# EAGLE design PDB2 (EAGLE 9.6.0)
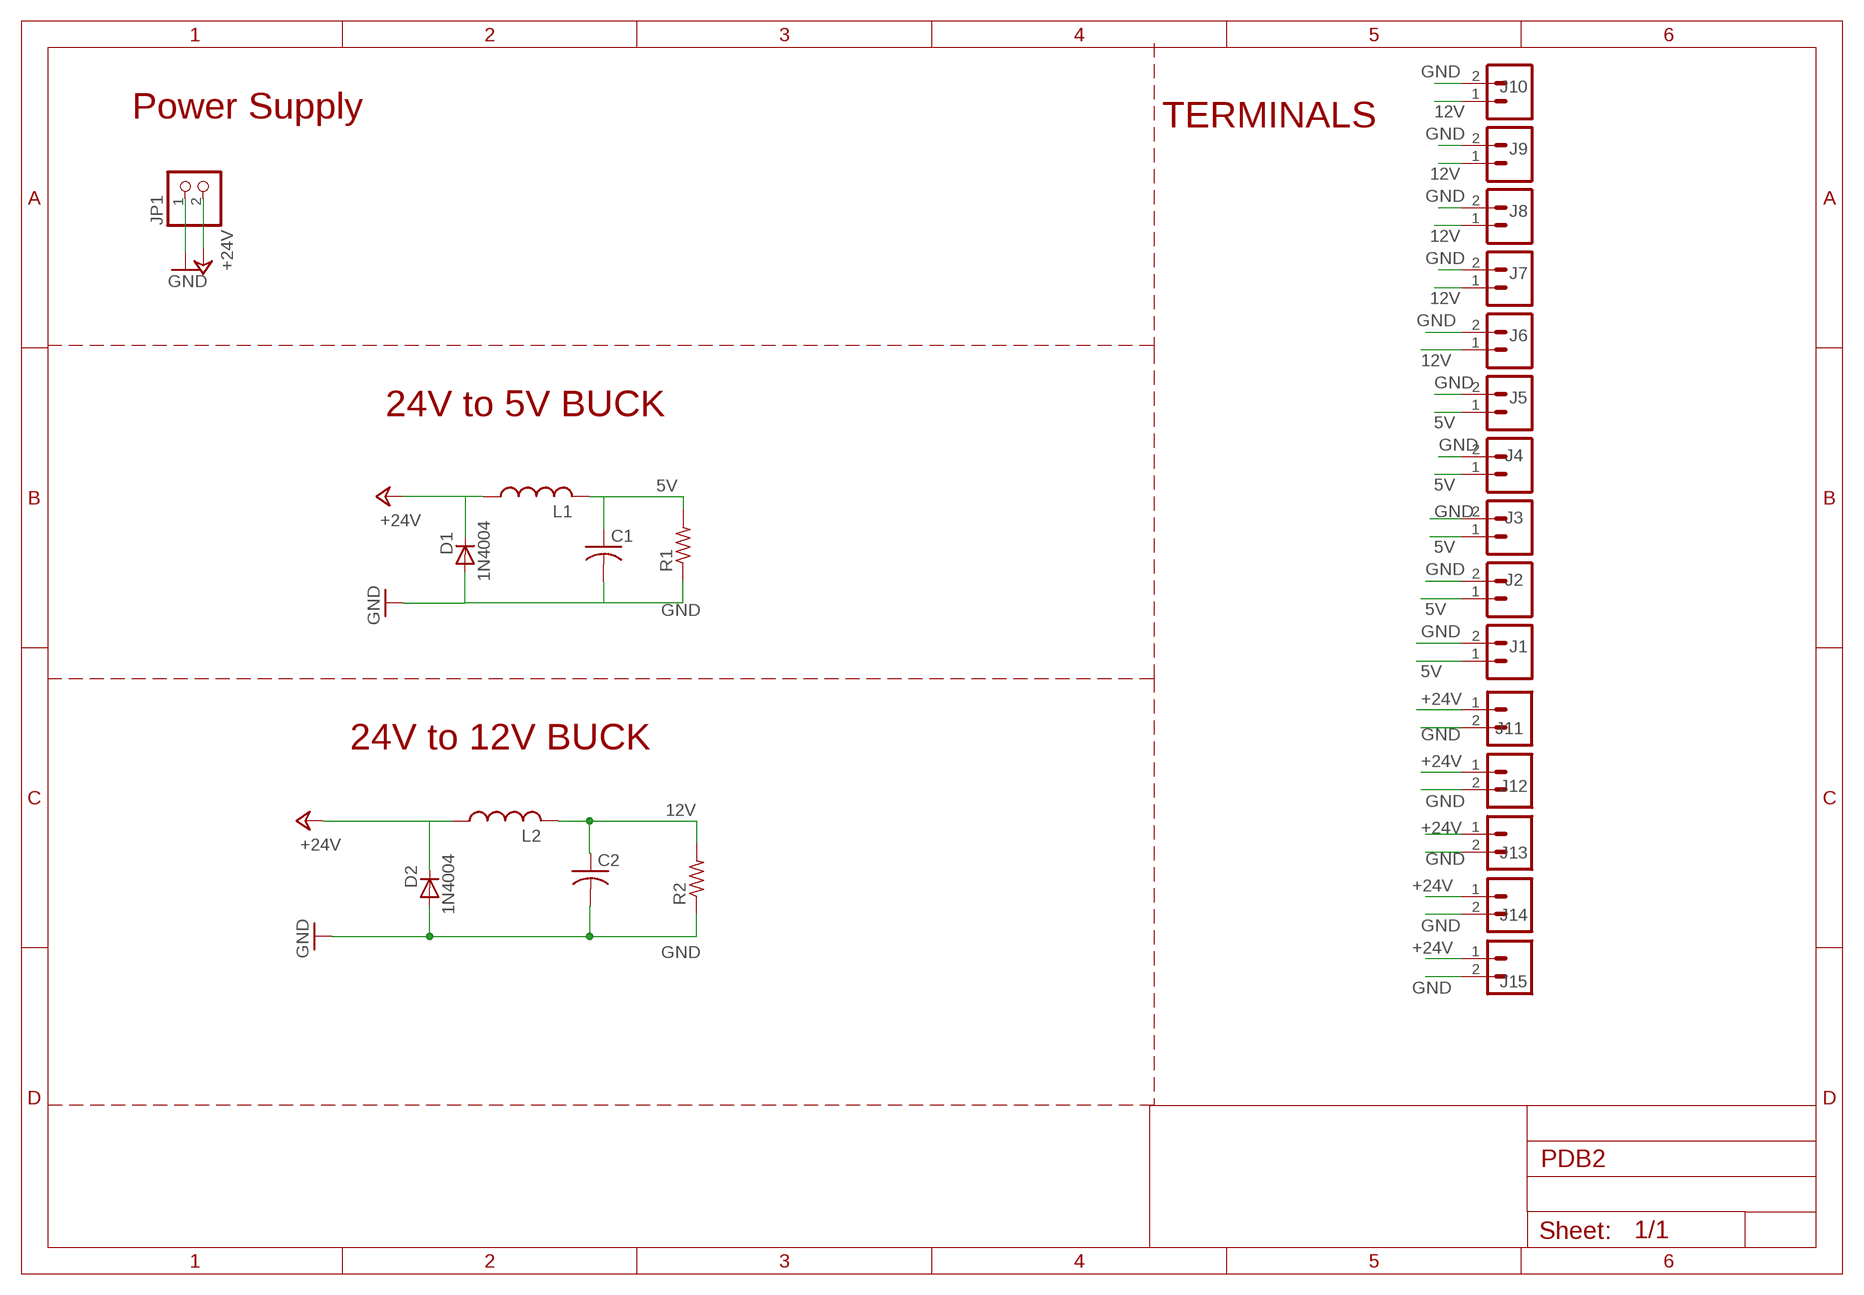
[diagram p0: schematic, sheet 1]

## Parts
C1  C-US025-050X050  [C025-050X050]
C2  C-US025-050X050  [C025-050X050]
D1  1N4004  [DO41-10]
D2  1N4004  [DO41-10]
J1  CONN_02  [1X02]
J2  CONN_02  [1X02]
J3  CONN_02  [1X02]
J4  CONN_02  [1X02]
J5  CONN_02  [1X02]
J6  CONN_02  [1X02]
J7  CONN_02  [1X02]
J8  CONN_02  [1X02]
J9  CONN_02  [1X02]
J10  CONN_02  [1X02]
J11  CONN_02  [1X02]
J12  CONN_02  [1X02]
J13  CONN_02  [1X02]
J14  CONN_02  [1X02]
J15  CONN_02  [1X02]
JP1  PINHD-1X2  [1X02]
L1  L-US0207/7  [0207/7]
L2  L-US0207/7  [0207/7]
R1  R-US_0207/10  [0207/10]
R2  R-US_0207/10  [0207/10]

## Nets
5V: C1.1 J1.1 J2.1 J3.1 J4.1 J5.1 L1.2 R1.2
12V: C2.1 J6.1 J7.1 J8.1 J9.1 J10.1 L2.2 R2.2
+24V: D1.C D2.C J11.1 J12.1 J13.1 J14.1 J15.1 JP1.2 L1.1 L2.1
GND: C1.2 C2.2 D1.A D2.A J1.2 J2.2 J3.2 J4.2 J5.2 J6.2 J7.2 J8.2 J9.2 J10.2 J11.2 J12.2 J13.2 J14.2 J15.2 JP1.1 R1.1 R2.1

## Notes on the sheet
- TERMINALS
- Power Supply
- 24V to 5V BUCK
- 24V to 12V BUCK

## Library data of the parts
C1 C2 = rcl:C-US: CAPACITOR, American symbol; SPICEPREFIX: C
D1 D2 = adafruit:1N4004: DIODE General purpose 1N400x type rectifier (With bigger pads) http://www.ladyada.net/library/pcb/eaglelibrary.html
J1-J15 = SparkFun-Connectors:CONN_02: Multi connection point. Often used as Generic Header-pin footprint for 0.1 inch spaced/style header connections On any of the 0.1 inch spaced packages, you can populate with these: Break Away Headers - Straight <https://www.sparkfun.com/products/116> (PRT-00116) Break Away Male Headers - Right Angle <https://www.sparkfun.com/products/553> (PRT-00553) Female Headers <https://www.sparkfun.com/products/115> (PRT-00115) Break Away Headers - Machine Pin <https://www.sparkfun.com/products/117> (PRT-00117) Break Away Female Headers - Swiss Machine Pin <https://www.sparkfun.com/products/743> (PRT-00743) For SCREWTERMINALS and SPRING TERMINALS visit here: Screw Terimnals on SparkFun.com <https://www.sparkfun.com/search/results?term=Screw+Terminals> (5mm/3.5mm/2.54mm spacing) This device is also useful as a general connection point to wire up your design to another part of your project. Our various solder wires solder well into these plated through hole pads. Hook-Up Wire - Assortment (Stranded, 22 AWG) <https://www.sparkfun.com/products/11375> (PRT-11375) Hook-Up Wire - Assortment (Solid Core, 22 AWG) <https://www.sparkfun.com/products/11367> (PRT-11367) View the entire wire category on our website here <https://www.sparkfun.com/categories/141> Special notes: Molex polarized connector foot print use with: PRT-08233 with associated crimp pins and housings. 2.54_SCREWTERM for use with PRT-10571. 3.5mm Screw Terminal footprints for PRT-08084 5mm Screw Terminal footprints for use with PRT-08432
JP1 = pinhead:PINHD-1X2: PIN HEADER
L1 L2 = rcl:L-US: INDUCTOR, American symbol; SPICEPREFIX: L
R1 R2 = rcl:R-US_: RESISTOR, American symbol; SPICEPREFIX: R

## Board
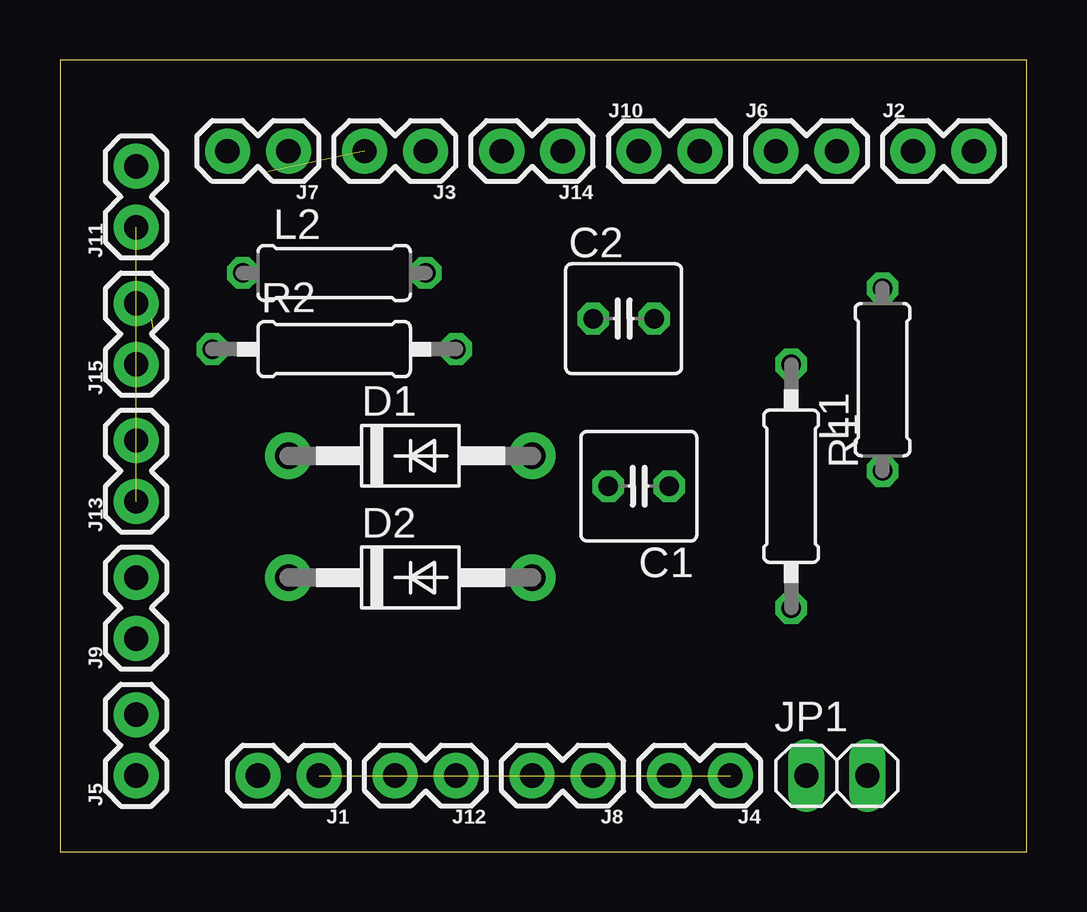
[diagram p1: board, top side]
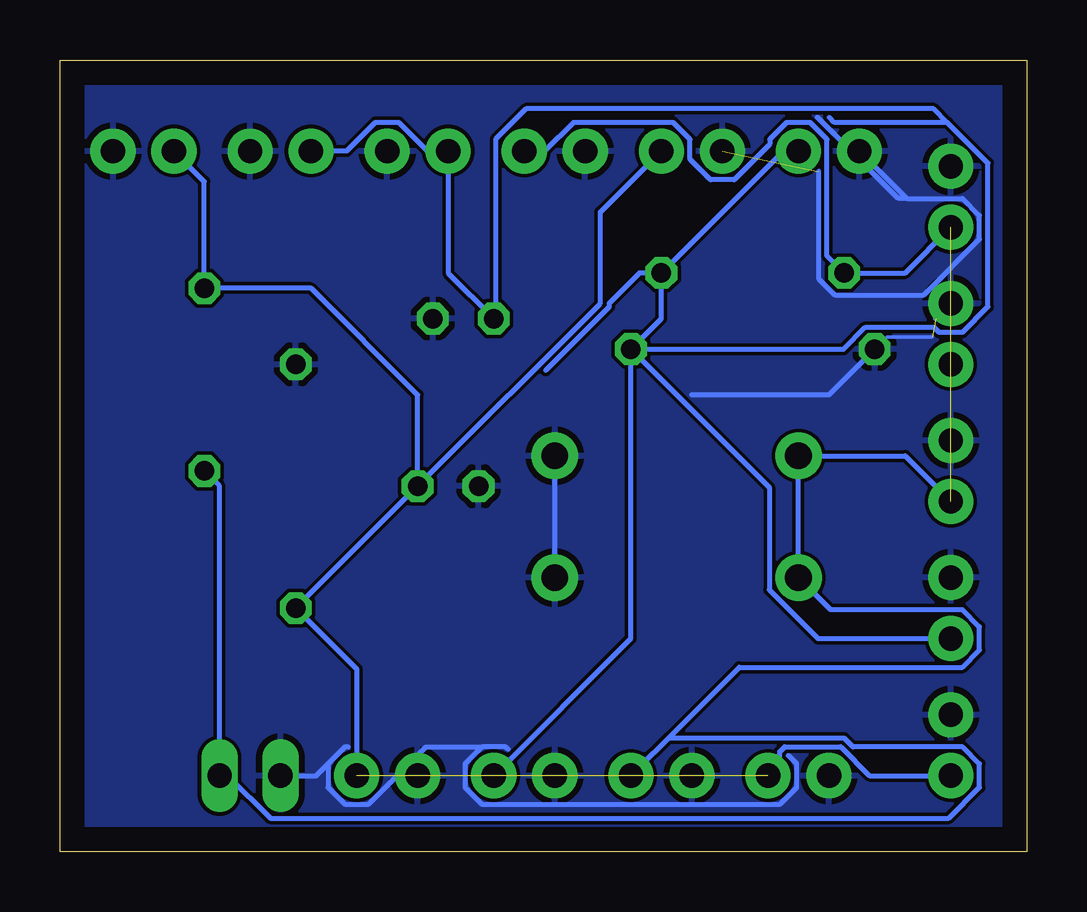
[diagram p2: board, bottom side, seen from below]

Size 40.31 x 33.01 mm. Coordinates in mm from the lower left corner, seen from the top.
Outline: 0,0 40.31,0 40.31,33.01 0,33.01 0,0
Copper layers (1*16): Top 0.035mm / dielectric 1.5mm / Bottom 0.035mm
Design rules "default": minimum track width 6mil, minimum drill 0.35mm, track to track 6mil, track to pad 6mil, pad to pad 6mil, via to via 6mil, smd to smd 6mil, copper to edge 40mil, drill to drill 6mil, minimum pad ring 10mil, minimum via ring 8mil, stop-mask expansion 4mil, vias tented up to drill 0mil, thermal gap 10mil

### Footprints (pad centres in the part's own frame; a part is rotated, then mirrored left to right if it is on the bottom)
C025-050X050 = drill 0.813 octagon: 1 -1.27,0; 2 1.27,0
DO41-10 = drill 1.118 pad 1.93: A 5.08,0; C -5.08,0
1X02 = drill 1.016 pad 1.88: 1 0,0; 2 2.54,0
1X02' = drill 1.016 long: 1 -1.27,0; 2 1.27,0
0207/7 = drill 0.813 octagon: 1 -3.81,0; 2 3.81,0
0207/10 = drill 0.813 octagon: 1 -5.08,0; 2 5.08,0

### Placement (x,y rotation side)
C1  24.13,15.24 180 top
C2  23.5,22.23 0 top
D1  14.61,16.51 0 top
D2  14.61,11.43 0 top
J1  10.79,3.18 180 top
J2  35.56,29.21 0 top
J3  15.24,29.21 180 top
J4  27.94,3.18 180 top
J5  3.17,3.18 90 top
J6  29.84,29.21 0 top
J7  9.53,29.21 180 top
J8  22.23,3.18 180 top
J9  3.17,8.89 90 top
J10  24.13,29.21 0 top
J11  3.17,26.04 90 top
J12  16.51,3.18 180 top
J13  3.17,14.61 90 top
J14  20.95,29.21 180 top
J15  3.17,20.32 90 top
JP1  [1X02']  32.38,3.18 0 top
L1  34.29,19.68 90 top
L2  11.43,24.13 0 top
R1  30.48,15.24 270 top
R2  11.43,20.96 0 top

### Tracks (layer width: path | path; a pad name or v marks a point on that pad's centre or on a via)
5V  (1 unrouted)
  Bottom 0.203: J4.1 27.94,7.62 R1.2 C1.1 | C1.1 25.4,19.05 29.84,23.49 L1.2 34.29,27.94 J2.1 | C1.1 17.78,22.86 17.78,26.67 J3.1 | J5.1 6.57,3.18 7.77,4.38 10.1,4.38 10.31,4.17 10.31,3.66 J1.1
12V
  Bottom 0.203: R2.2 15.24,22.23 L2.2 | L2.2 10.16,29.21 J7.1 | R2.2 10.74,15.19 10.74,10.93 8.71,8.89 J9.1 | J8.1 16.51,8.89 R2.2 | J6.1 28.36,29.21 27.16,30.4 26.18,30.4 24.98,29.21 J10.1 24.13,24.13 C2.1 22.15,22.3 22.15,29.7 20.88,30.98 3.89,30.98 3.32,30.4 | 8.24,30.62 8.03,30.4 3.32,30.4 | L2.2 16.15,24.13 17.42,22.86 17.42,22.71 20.07,20.07 | 3.32,30.4 1.63,28.71 1.63,22.72 2.68,21.67 3.67,21.67 3.87,21.87 6.73,21.87 7.64,20.96 R2.2 | R2.2 15.6,21.87
+24V  (2 unrouted)
  Bottom 0.203: J14.1 20.1,29.21 18.91,30.4 14.75,30.4 14.05,29.7 14.05,28.87 13.19,28.02 12.21,28.02 10.72,29.5 10.72,29.7 10.02,30.4 9.03,30.4 8.33,29.7 8.33,24.84 L2.1 5.08,24.13 J11.1 | D1.C 8.89,16.51 | 8.89,16.51 5.08,16.51 J13.1 | 8.89,16.51 9.53,15.88 D2.C 8.18,10.08 2.68,10.08 1.98,9.38 1.98,8.4 2.68,7.7 11.99,7.7 14.96,4.73 | J12.1 16.19,3.49 14.96,4.73 | L1.1 33.66,15.24 JP1.2 33.31,3.18 31.54,1.4 3.27,1.4 1.98,2.68 1.98,3.67 2.68,4.37 7.26,4.37 7.62,4.73 14.96,4.73
GND  (2 unrouted)
  Bottom 0.152: R2.1 5.84,21.46 3.94,21.46
  Bottom 0.203: D2.A 20.32,10.8 | 19.68,10.8 D1.A | JP1.1 29.63,3.18 29.13,3.67 | 28.3,4.37 28.43,4.37 29.13,3.67 | 29.13,3.67 29.13,2.68 28.43,1.98 27.45,1.98 25.06,4.37 22.72,4.37 | 21.63,4.27 21.73,4.37 22.72,4.37 | 22.72,4.37 23.42,3.67 23.42,2.68 22.72,1.98 10.3,1.98 9.6,2.68 9.6,3.67 9.95,4.02 | J7.2 5,27.23 | 5,27.23 2.68,27.23 1.98,26.53 1.98,25.54 4.31,23.22 8,23.22 8.69,23.9 8.69,28.36 | 5,27.23 5.35,27.23 8.75,30.62 | R2.1 8.26,19.05 13.97,19.05 | J15.2 3.81,22.23
  pour Bottom: 40.64,0 40.64,33.02 0,33.02 0,0